# EAGLE design Peripheral (EAGLE 7.6.0)
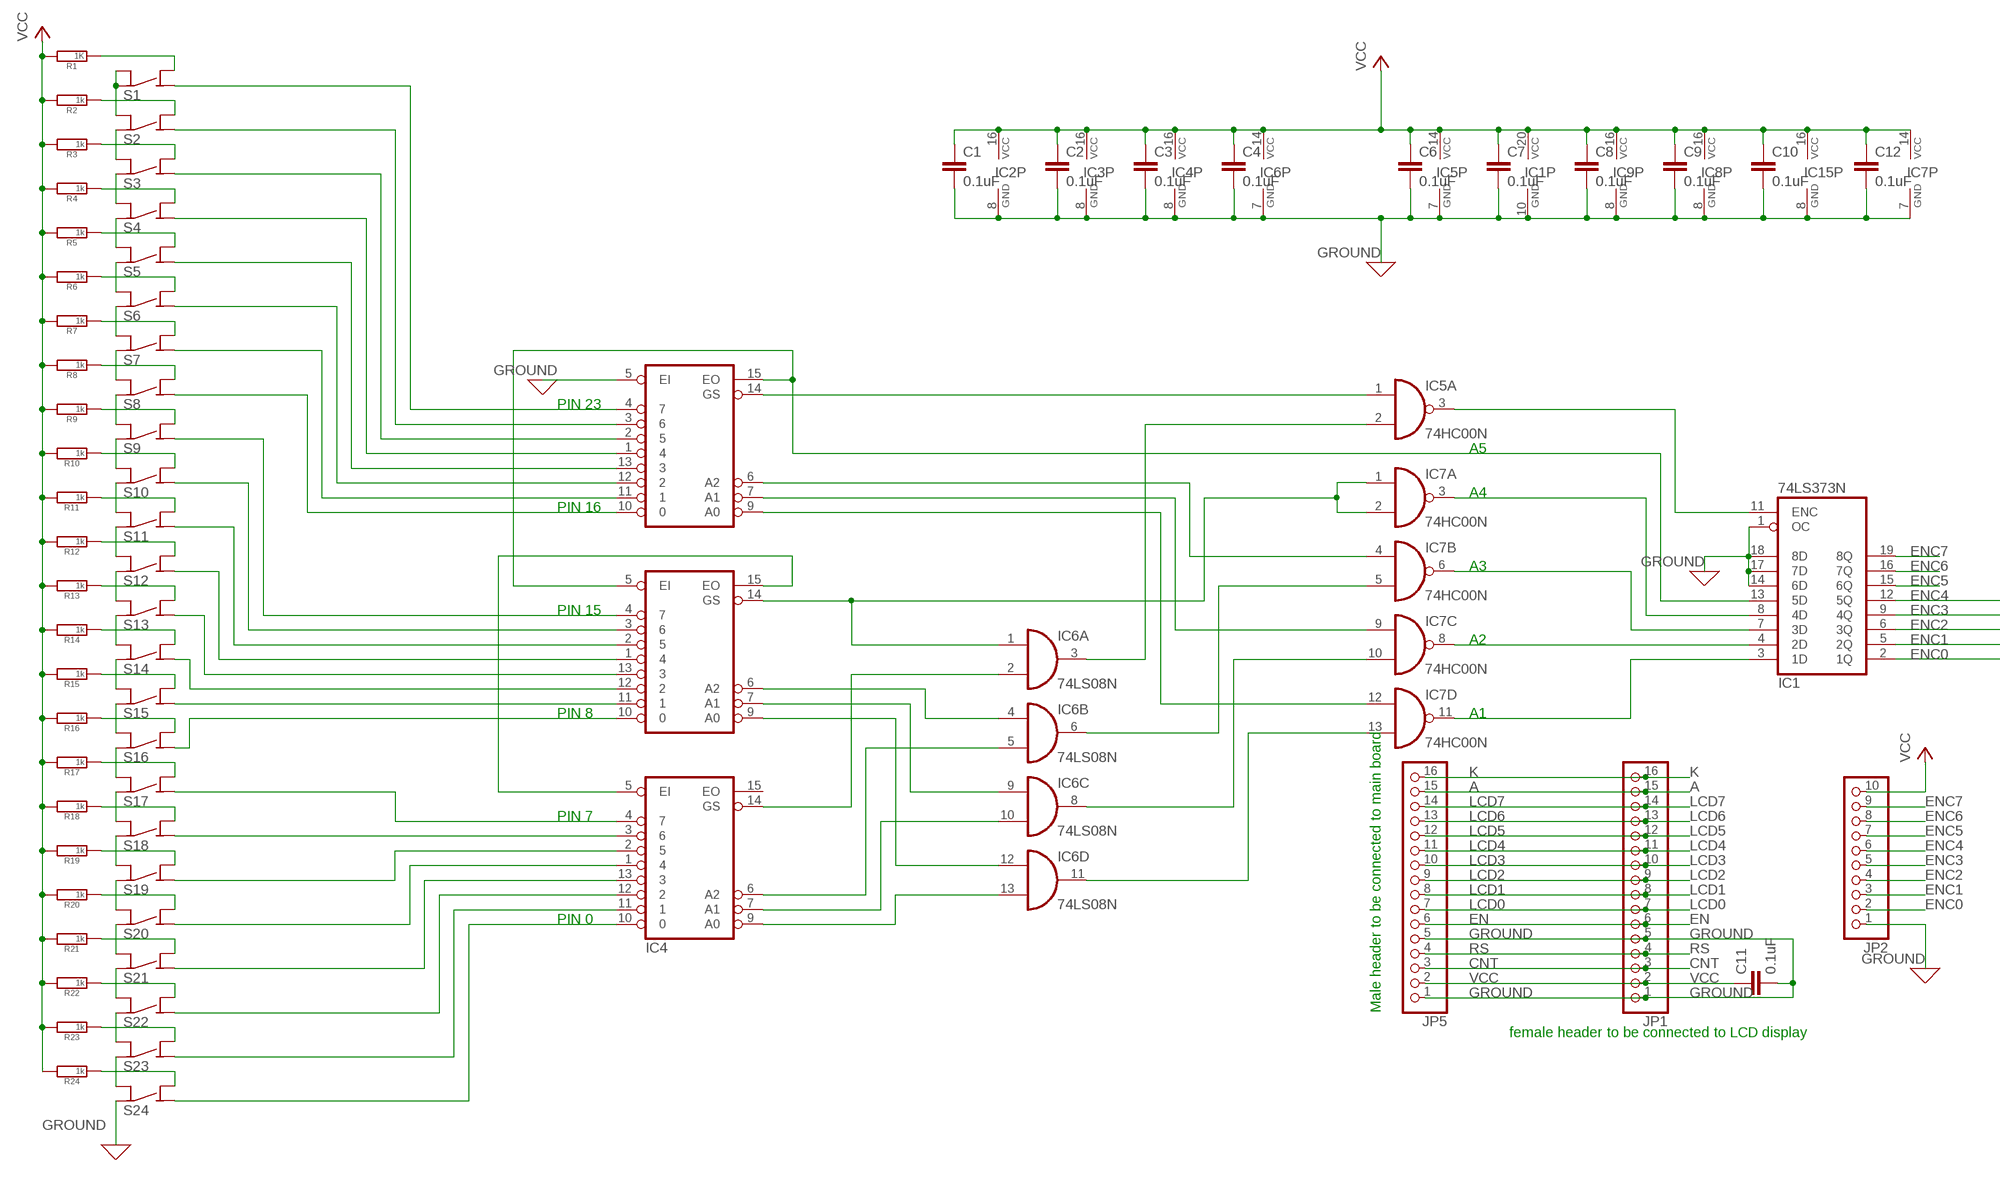
[diagram p0: schematic, sheet 1, part 1 of 2]
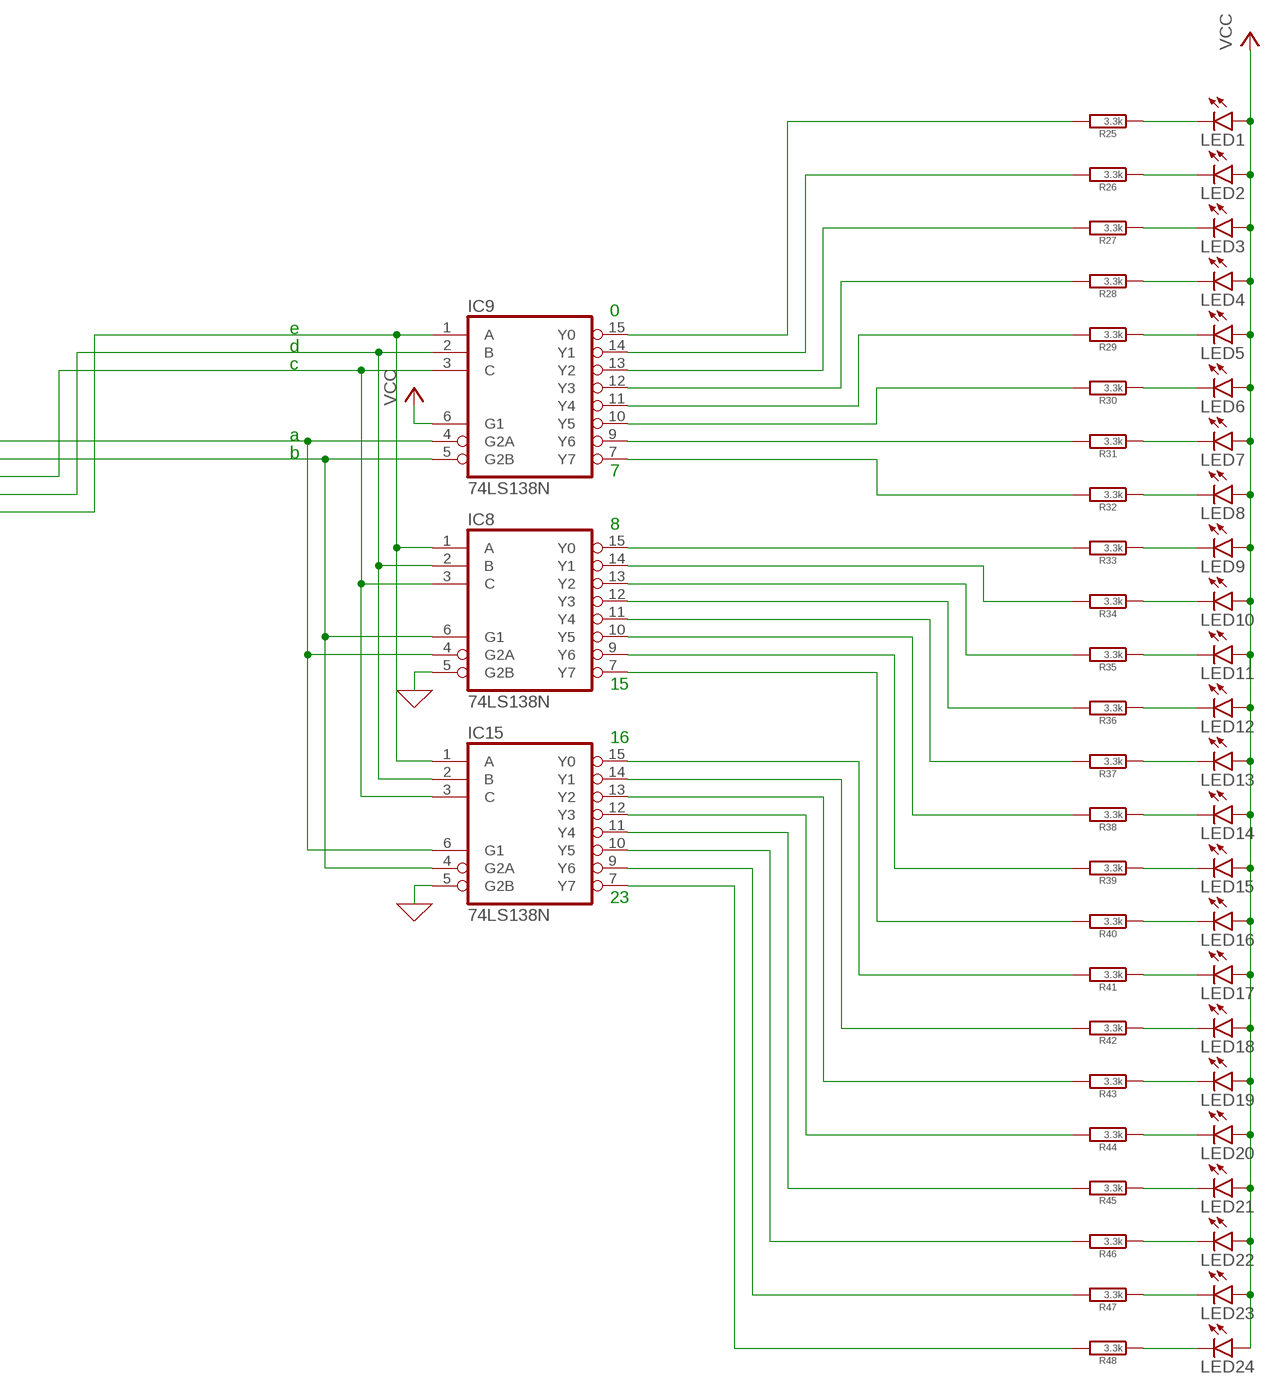
[diagram p1: schematic, sheet 1, part 2 of 2]

## Parts
C1  0.1uF  C2.5/2  [C2.5-2]
C2  0.1uF  C2.5/2  [C2.5-2]
C3  0.1uF  C2.5/2  [C2.5-2]
C4  0.1uF  C2.5/2  [C2.5-2]
C6  0.1uF  C2.5/2  [C2.5-2]
C7  0.1uF  C2.5/2  [C2.5-2]
C8  0.1uF  C2.5/2  [C2.5-2]
C9  0.1uF  C2.5/2  [C2.5-2]
C10  0.1uF  C2.5/2  [C2.5-2]
C11  0.1uF  C-EU025-025X050  [C025-025X050]
C12  0.1uF  C2.5/2  [C2.5-2]
IC1  74LS373N  [DIL20]
IC2  74HC148N  [DIL16]
IC3  74HC148N  [DIL16]
IC4  74HC148N  [DIL16]
IC5  74HC00N  [DIL14]
IC6  74LS08N  [DIL14]
IC7  74HC00N  [DIL14]
IC8  74LS138N  [DIL16]
IC9  74LS138N  [DIL16]
IC15  74LS138N  [DIL16]
JP1  PINHD-1X16  [1X16]
JP2  PINHD-1X10  [1X10]
JP5  PINHD-1X16  [1X16]
LED1  LED5MM  [LED5MM]
LED2  LED5MM  [LED5MM]
LED3  LED5MM  [LED5MM]
LED4  LED5MM  [LED5MM]
LED5  LED5MM  [LED5MM]
LED6  LED5MM  [LED5MM]
LED7  LED5MM  [LED5MM]
LED8  LED5MM  [LED5MM]
LED9  LED5MM  [LED5MM]
LED10  LED5MM  [LED5MM]
LED11  LED5MM  [LED5MM]
LED12  LED5MM  [LED5MM]
LED13  LED5MM  [LED5MM]
LED14  LED5MM  [LED5MM]
LED15  LED5MM  [LED5MM]
LED16  LED5MM  [LED5MM]
LED17  LED5MM  [LED5MM]
LED18  LED5MM  [LED5MM]
LED19  LED5MM  [LED5MM]
LED20  LED5MM  [LED5MM]
LED21  LED5MM  [LED5MM]
LED22  LED5MM  [LED5MM]
LED23  LED5MM  [LED5MM]
LED24  LED5MM  [LED5MM]
R1  1K  R>>1/6W(5MM)  [1/6W(5MM)]
R2  1k  R>>1/6W(5MM)  [1/6W(5MM)]
R3  1k  R>>1/6W(5MM)  [1/6W(5MM)]
R4  1k  R>>1/6W(5MM)  [1/6W(5MM)]
R5  1k  R>>1/6W(5MM)  [1/6W(5MM)]
R6  1k  R>>1/6W(5MM)  [1/6W(5MM)]
R7  1k  R>>1/6W(5MM)  [1/6W(5MM)]
R8  1k  R>>1/6W(5MM)  [1/6W(5MM)]
R9  1k  R>>1/6W(5MM)  [1/6W(5MM)]
R10  1k  R>>1/6W(5MM)  [1/6W(5MM)]
R11  1k  R>>1/6W(5MM)  [1/6W(5MM)]
R12  1k  R>>1/6W(5MM)  [1/6W(5MM)]
R13  1k  R>>1/6W(5MM)  [1/6W(5MM)]
R14  1k  R>>1/6W(5MM)  [1/6W(5MM)]
R15  1k  R>>1/6W(5MM)  [1/6W(5MM)]
R16  1k  R>>1/6W(5MM)  [1/6W(5MM)]
R17  1k  R>>1/6W(5MM)  [1/6W(5MM)]
R18  1k  R>>1/6W(5MM)  [1/6W(5MM)]
R19  1k  R>>1/6W(5MM)  [1/6W(5MM)]
R20  1k  R>>1/6W(5MM)  [1/6W(5MM)]
R21  1k  R>>1/6W(5MM)  [1/6W(5MM)]
R22  1k  R>>1/6W(5MM)  [1/6W(5MM)]
R23  1k  R>>1/6W(5MM)  [1/6W(5MM)]
R24  1k  R>>1/6W(5MM)  [1/6W(5MM)]
R25  3.3k  R>>1/6W(5MM)  [1/6W(5MM)]
R26  3.3k  R>>1/6W(5MM)  [1/6W(5MM)]
R27  3.3k  R>>1/6W(5MM)  [1/6W(5MM)]
R28  3.3k  R>>1/6W(5MM)  [1/6W(5MM)]
R29  3.3k  R>>1/6W(5MM)  [1/6W(5MM)]
R30  3.3k  R>>1/6W(5MM)  [1/6W(5MM)]
R31  3.3k  R>>1/6W(5MM)  [1/6W(5MM)]
R32  3.3k  R>>1/6W(5MM)  [1/6W(5MM)]
R33  3.3k  R>>1/6W(5MM)  [1/6W(5MM)]
R34  3.3k  R>>1/6W(5MM)  [1/6W(5MM)]
R35  3.3k  R>>1/6W(5MM)  [1/6W(5MM)]
R36  3.3k  R>>1/6W(5MM)  [1/6W(5MM)]
R37  3.3k  R>>1/6W(5MM)  [1/6W(5MM)]
R38  3.3k  R>>1/6W(5MM)  [1/6W(5MM)]
R39  3.3k  R>>1/6W(5MM)  [1/6W(5MM)]
R40  3.3k  R>>1/6W(5MM)  [1/6W(5MM)]
R41  3.3k  R>>1/6W(5MM)  [1/6W(5MM)]
R42  3.3k  R>>1/6W(5MM)  [1/6W(5MM)]
R43  3.3k  R>>1/6W(5MM)  [1/6W(5MM)]
R44  3.3k  R>>1/6W(5MM)  [1/6W(5MM)]
R45  3.3k  R>>1/6W(5MM)  [1/6W(5MM)]
R46  3.3k  R>>1/6W(5MM)  [1/6W(5MM)]
R47  3.3k  R>>1/6W(5MM)  [1/6W(5MM)]
R48  3.3k  R>>1/6W(5MM)  [1/6W(5MM)]
S1  SPST4B3F-10XX  [B3F-10XX]
S2  SPST4B3F-10XX  [B3F-10XX]
S3  SPST4B3F-10XX  [B3F-10XX]
S4  SPST4B3F-10XX  [B3F-10XX]
S5  SPST4B3F-10XX  [B3F-10XX]
S6  SPST4B3F-10XX  [B3F-10XX]
S7  SPST4B3F-10XX  [B3F-10XX]
S8  SPST4B3F-10XX  [B3F-10XX]
S9  SPST4B3F-10XX  [B3F-10XX]
S10  SPST4B3F-10XX  [B3F-10XX]
S11  SPST4B3F-10XX  [B3F-10XX]
S12  SPST4B3F-10XX  [B3F-10XX]
S13  SPST4B3F-10XX  [B3F-10XX]
S14  SPST4B3F-10XX  [B3F-10XX]
S15  SPST4B3F-10XX  [B3F-10XX]
S16  SPST4B3F-10XX  [B3F-10XX]
S17  SPST4B3F-10XX  [B3F-10XX]
S18  SPST4B3F-10XX  [B3F-10XX]
S19  SPST4B3F-10XX  [B3F-10XX]
S20  SPST4B3F-10XX  [B3F-10XX]
S21  SPST4B3F-10XX  [B3F-10XX]
S22  SPST4B3F-10XX  [B3F-10XX]
S23  SPST4B3F-10XX  [B3F-10XX]
S24  SPST4B3F-10XX  [B3F-10XX]

## Nets
A: JP1.15 JP5.15
CNT: JP1.3 JP5.3
EN: JP1.6 JP5.6
ENC0: IC1.2(1Q) IC8.1(A) IC9.1(A) IC15.1(A) JP2.2
ENC1: IC1.5(2Q) IC8.2(B) IC9.2(B) IC15.2(B) JP2.3
ENC2: IC1.6(3Q) IC8.3(C) IC9.3(C) IC15.3(C) JP2.4
ENC3: IC1.9(4Q) IC8.6(G1) IC9.5(G2B) IC15.4(G2A) JP2.5
ENC4: IC1.12(5Q) IC8.4(G2A) IC9.4(G2A) IC15.6(G1) JP2.6
ENC5: IC1.15(6Q) JP2.7
ENC6: IC1.16(7Q) JP2.8
ENC7: IC1.19(8Q) JP2.9
GROUND [GND]: C1.2 C2.2 C3.2 C4.2 C6.2 C7.2 C8.2 C9.2 C10.2 C11.2 C12.2 IC1.1(OC) IC1.10(GND) IC1.14(6D) IC1.17(7D) IC1.18(8D) IC2.5(EI) IC2.8(GND) IC3.8(GND) IC4.8(GND) IC5.7(P:GND) IC6.7(P:GND) IC7.7(P:GND) IC8.5(G2B) IC8.8(GND) IC9.8(GND) IC15.5(G2B) IC15.8(GND) JP1.1 JP1.5 JP2.1 JP5.1 JP5.5 S1.COM@1(COM) S1.COM@2(COM) S2.COM@1(COM) S2.COM@2(COM) S3.COM@1(COM) S3.COM@2(COM) S4.COM@1(COM) S4.COM@2(COM) S5.COM@1(COM) S5.COM@2(COM) S6.COM@1(COM) S6.COM@2(COM) S7.COM@1(COM) S7.COM@2(COM) S8.COM@1(COM) S8.COM@2(COM) S9.COM@1(COM) S9.COM@2(COM) S10.COM@1(COM) S10.COM@2(COM) S11.COM@1(COM) S11.COM@2(COM) S12.COM@1(COM) S12.COM@2(COM) S13.COM@1(COM) S13.COM@2(COM) S14.COM@1(COM) S14.COM@2(COM) S15.COM@1(COM) S15.COM@2(COM) S16.COM@1(COM) S16.COM@2(COM) S17.COM@1(COM) S17.COM@2(COM) S18.COM@1(COM) S18.COM@2(COM) S19.COM@1(COM) S19.COM@2(COM) S20.COM@1(COM) S20.COM@2(COM) S21.COM@1(COM) S21.COM@2(COM) S22.COM@1(COM) S22.COM@2(COM) S23.COM@1(COM) S23.COM@2(COM) S24.COM@1(COM) S24.COM@2(COM) ; supply symbol labelled GND
K: JP1.16 JP5.16
LCD0: JP1.7 JP5.7
LCD1: JP1.8 JP5.8
LCD2: JP1.9 JP5.9
LCD3: JP1.10 JP5.10
LCD4: JP1.11 JP5.11
LCD5: JP1.12 JP5.12
LCD6: JP1.13 JP5.13
LCD7: JP1.14 JP5.14
N$1: IC2.10 S8.NO@1(NO)
N$3: IC3.15(EO) IC4.5(EI)
N$4: IC2.11 S7.NO@1(NO)
N$5: IC2.9(A0) IC7.12(D:I0)
N$6: IC2.12 S6.NO@1(NO)
N$7: IC2.7(A1) IC7.9(C:I0)
N$8: IC2.13 S5.NO@1(NO)
N$9: IC2.1 S4.NO@1(NO)
N$10: IC3.9(A0) IC6.12(D:I0)
N$11: IC4.9(A0) IC6.13(D:I1)
N$12: IC3.7(A1) IC6.9(C:I0)
N$13: IC4.7(A1) IC6.10(C:I1)
N$14: IC3.6(A2) IC6.4(B:I0)
N$15: IC4.6(A2) IC6.5(B:I1)
N$16: IC2.2 S3.NO@1(NO)
N$17: IC6.11(D:O) IC7.13(D:I1)
N$18: IC2.3 S2.NO@1(NO)
N$19: IC6.8(C:O) IC7.10(C:I1)
N$20: IC2.6(A2) IC7.4(B:I0)
N$21: IC6.6(B:O) IC7.5(B:I1)
N$22: IC4.4 S17.NO@1(NO)
N$23: IC3.14(GS) IC6.1(A:I0) IC7.1(A:I0) IC7.2(A:I1)
N$24: R1.1 S1.NO@2(NO)
N$31: R2.1 S2.NO@2(NO)
N$32: R3.1 S3.NO@2(NO)
N$33: R4.1 S4.NO@2(NO)
N$34: R5.1 S5.NO@2(NO)
N$35: R6.1 S6.NO@2(NO)
N$36: R7.1 S7.NO@2(NO)
N$54: R8.1 S8.NO@2(NO)
N$55: R9.1 S9.NO@2(NO)
N$56: R10.1 S10.NO@2(NO)
N$57: R11.1 S11.NO@2(NO)
N$58: R12.1 S12.NO@2(NO)
N$59: R13.1 S13.NO@2(NO)
N$60: R14.1 S14.NO@2(NO)
N$61: R15.1 S15.NO@2(NO)
N$62: R16.1 S16.NO@2(NO)
N$63: R17.1 S17.NO@2(NO)
N$64: R18.1 S18.NO@2(NO)
N$65: R19.1 S19.NO@2(NO)
N$66: R20.1 S20.NO@2(NO)
N$67: R21.1 S21.NO@2(NO)
N$68: R22.1 S22.NO@2(NO)
N$69: R23.1 S23.NO@2(NO)
N$70: R24.1 S24.NO@2(NO)
N$71: IC1.3(1D) IC7.11(D:O)
N$72: IC1.4(2D) IC7.8(C:O)
N$73: IC4.2 S19.NO@1(NO)
N$74: IC4.1 S20.NO@1(NO)
N$75: IC4.13 S21.NO@1(NO)
N$76: IC4.12 S22.NO@1(NO)
N$77: IC4.11 S23.NO@1(NO)
N$78: IC4.10 S24.NO@1(NO)
N$79: IC4.3 S18.NO@1(NO)
N$80: IC1.7(3D) IC7.6(B:O)
N$81: IC1.8(4D) IC7.3(A:O)
N$82: IC4.14(GS) IC6.2(A:I1)
N$83: IC2.14(GS) IC5.1(A:I0)
N$84: IC2.4 S1.NO@1(NO)
N$85: IC5.2(A:I1) IC6.3(A:O)
N$86: IC3.4 S9.NO@1(NO)
N$87: IC3.10 S16.NO@1(NO)
N$88: IC3.11 S15.NO@1(NO)
N$89: IC3.12 S14.NO@1(NO)
N$90: IC3.13 S13.NO@1(NO)
N$91: IC3.1 S12.NO@1(NO)
N$92: IC3.2 S11.NO@1(NO)
N$93: IC3.3 S10.NO@1(NO)
N$94: IC1.11(ENC) IC5.3(A:O)
N$98: IC1.13(5D) IC2.15(EO) IC3.5(EI)
N$151: IC9.15(Y0) R25.2
N$152: LED1.K(C) R25.1
N$153: IC9.14(Y1) R26.2
N$154: IC9.13(Y2) R27.2
N$155: IC9.12(Y3) R28.2
N$156: IC9.11(Y4) R29.2
N$157: IC9.10(Y5) R30.2
N$158: IC9.9(Y6) R31.2
N$159: IC9.7(Y7) R32.2
N$160: IC8.15(Y0) R33.2
N$161: IC8.14(Y1) R34.2
N$162: IC8.13(Y2) R35.2
N$163: IC8.12(Y3) R36.2
N$164: IC8.11(Y4) R37.2
N$165: IC8.10(Y5) R38.2
N$166: IC8.9(Y6) R39.2
N$167: IC8.7(Y7) R40.2
N$168: IC15.15(Y0) R41.2
N$169: IC15.14(Y1) R42.2
N$170: IC15.13(Y2) R43.2
N$171: IC15.12(Y3) R44.2
N$172: IC15.11(Y4) R45.2
N$173: IC15.10(Y5) R46.2
N$174: IC15.9(Y6) R47.2
N$175: IC15.7(Y7) R48.2
N$176: LED2.K(C) R26.1
N$177: LED3.K(C) R27.1
N$178: LED4.K(C) R28.1
N$179: LED5.K(C) R29.1
N$180: LED6.K(C) R30.1
N$181: LED7.K(C) R31.1
N$182: LED8.K(C) R32.1
N$183: LED9.K(C) R33.1
N$184: LED10.K(C) R34.1
N$185: LED11.K(C) R35.1
N$186: LED12.K(C) R36.1
N$187: LED13.K(C) R37.1
N$188: LED14.K(C) R38.1
N$189: LED15.K(C) R39.1
N$190: LED16.K(C) R40.1
N$191: LED17.K(C) R41.1
N$192: LED18.K(C) R42.1
N$193: LED19.K(C) R43.1
N$194: LED20.K(C) R44.1
N$195: LED21.K(C) R45.1
N$196: LED22.K(C) R46.1
N$199: LED23.K(C) R47.1
N$200: LED24.K(C) R48.1
RS: JP1.4 JP5.4
VCC [VCC]: C1.1 C2.1 C3.1 C4.1 C6.1 C7.1 C8.1 C9.1 C10.1 C11.1 C12.1 IC1.20(VCC) IC2.16(VCC) IC3.16(VCC) IC4.16(VCC) IC5.14(P:VCC) IC6.14(P:VCC) IC7.14(P:VCC) IC8.16(VCC) IC9.6(G1) IC9.16(VCC) IC15.16(VCC) JP1.2 JP2.10 JP5.2 LED1.A LED2.A LED3.A LED4.A LED5.A LED6.A LED7.A LED8.A LED9.A LED10.A LED11.A LED12.A LED13.A LED14.A LED15.A LED16.A LED17.A LED18.A LED19.A LED20.A LED21.A LED22.A LED23.A LED24.A R1.2 R2.2 R3.2 R4.2 R5.2 R6.2 R7.2 R8.2 R9.2 R10.2 R11.2 R12.2 R13.2 R14.2 R15.2 R16.2 R17.2 R18.2 R19.2 R20.2 R21.2 R22.2 R23.2 R24.2
Unconnected: IC4.15(EO) IC5.4(B:I0) IC5.5(B:I1) IC5.6(B:O) IC5.8(C:O) IC5.9(C:I0) IC5.10(C:I1) IC5.11(D:O) IC5.12(D:I0) IC5.13(D:I1)

## Notes on the sheet
- PIN 23
- A5
- A4 | 0
- PIN 16 | e
- d
- c
- A3
- a
- PIN 15 | b
- 7
- A2
- 8
- PIN 8 | A1
- 15
- PIN 7
- 16
- PIN 0
- 23
- Male header to be connected to main board
- female header to be connected to LCD display

## Library data of the parts
C1-C4 C6-C10 C12 = capacitor-wima:C: CAPACITOR naming: grid - package width
C11 = rcl:C-EU: CAPACITOR, European symbol; SPICEPREFIX: C
IC1 = 74xx-eu:74*373: Octal D type transparent LATCH, edge triggered
IC2-IC4 = 74xx-eu:74*148: 10-line to 4-line and 8-line to 3-line PRIORITY ENCODER
IC5 IC7 = 74xx-eu:74*00: Quad 2-input NAND gate
IC6 = 74xx-eu:74*08: Quad 2-input AND gate
IC8 IC9 IC15 = 74xx-eu:74*138: 3-line to 8-line DECODER/DEMULTIPLEXER
JP1 JP5 = pinhead:PINHD-1X16: PIN HEADER
JP2 = pinhead:PINHD-1X10: PIN HEADER
LED1-LED24 = bt_opto:LED: LED Various packages
R1-R48 = !Resistor(抵抗):R>>: RESISTOR, European symbol
S1-S24 = bt_electromech:SPST4: SPST switch with 2 pins per contact

## Net classes
0 default: width 0.406 mm, drill 0.254 mm, clearance 0.254 mm
1 VCC: width 0.61 mm, drill 0.254 mm, clearance 0.254 mm
2 GND: width 0.61 mm, drill 0.254 mm, clearance 0.254 mm

## Board
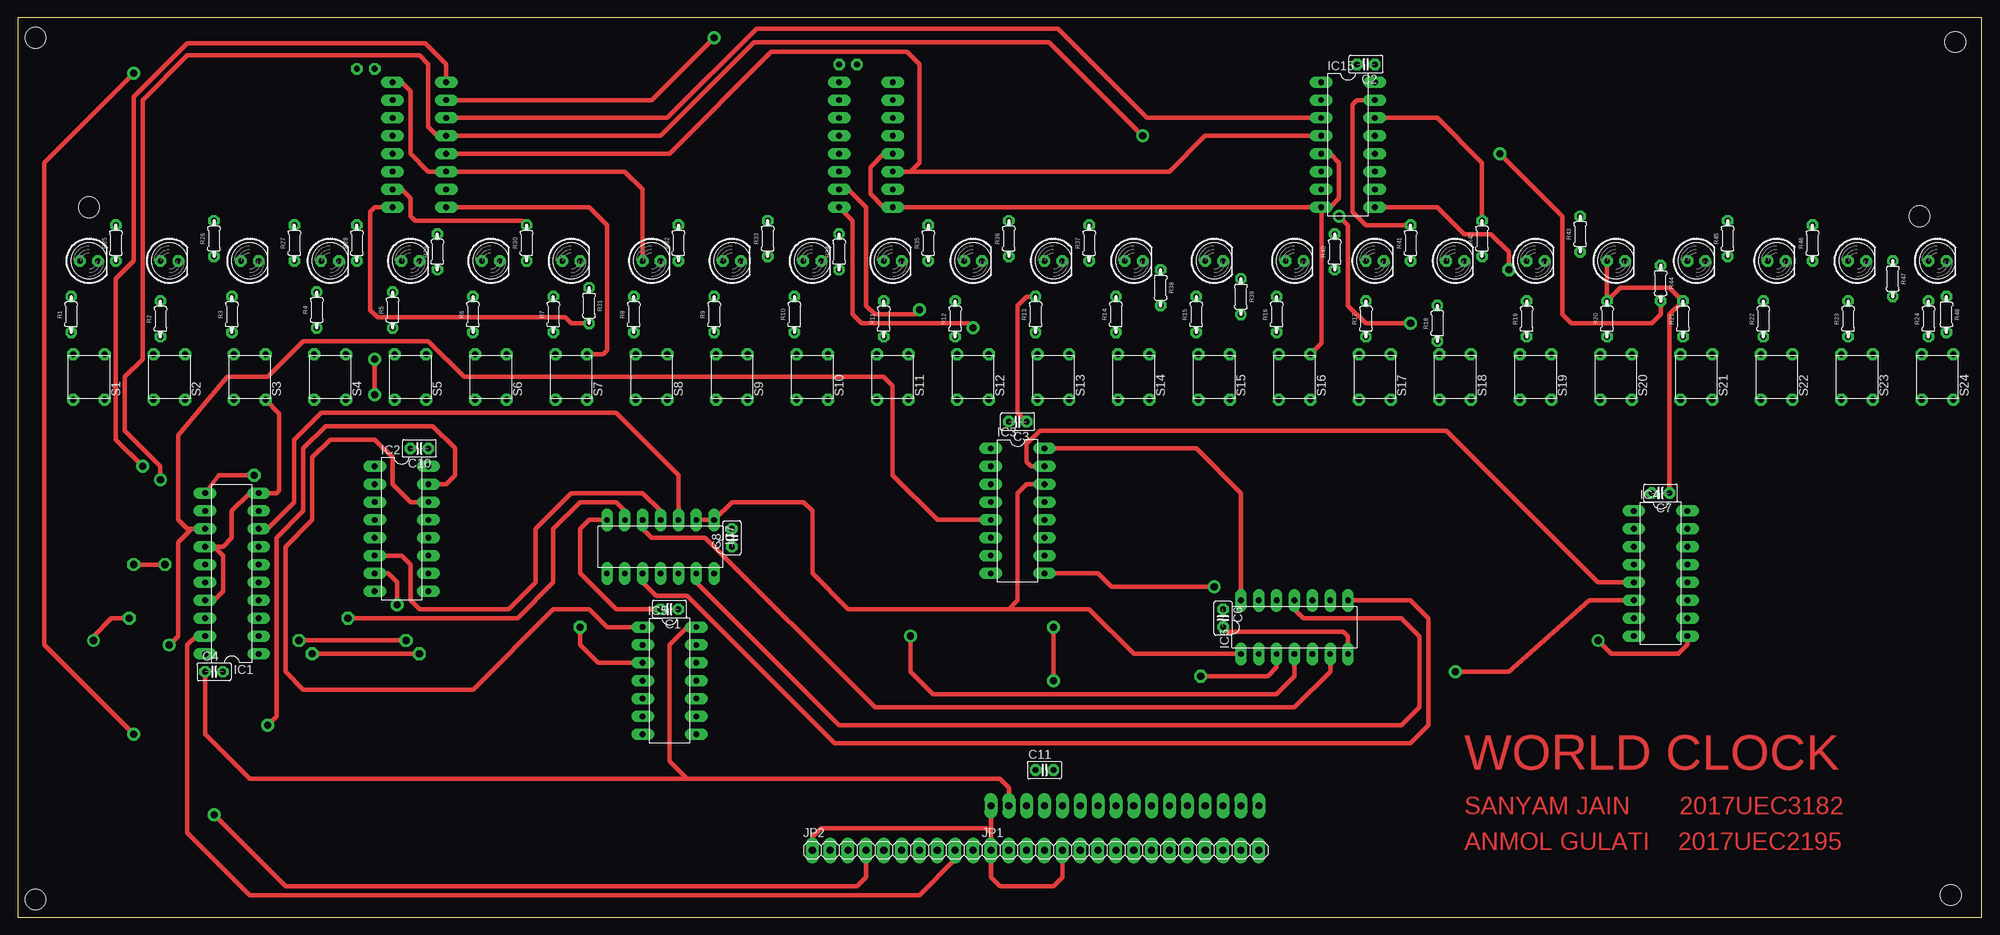
[diagram p2: board, top side]
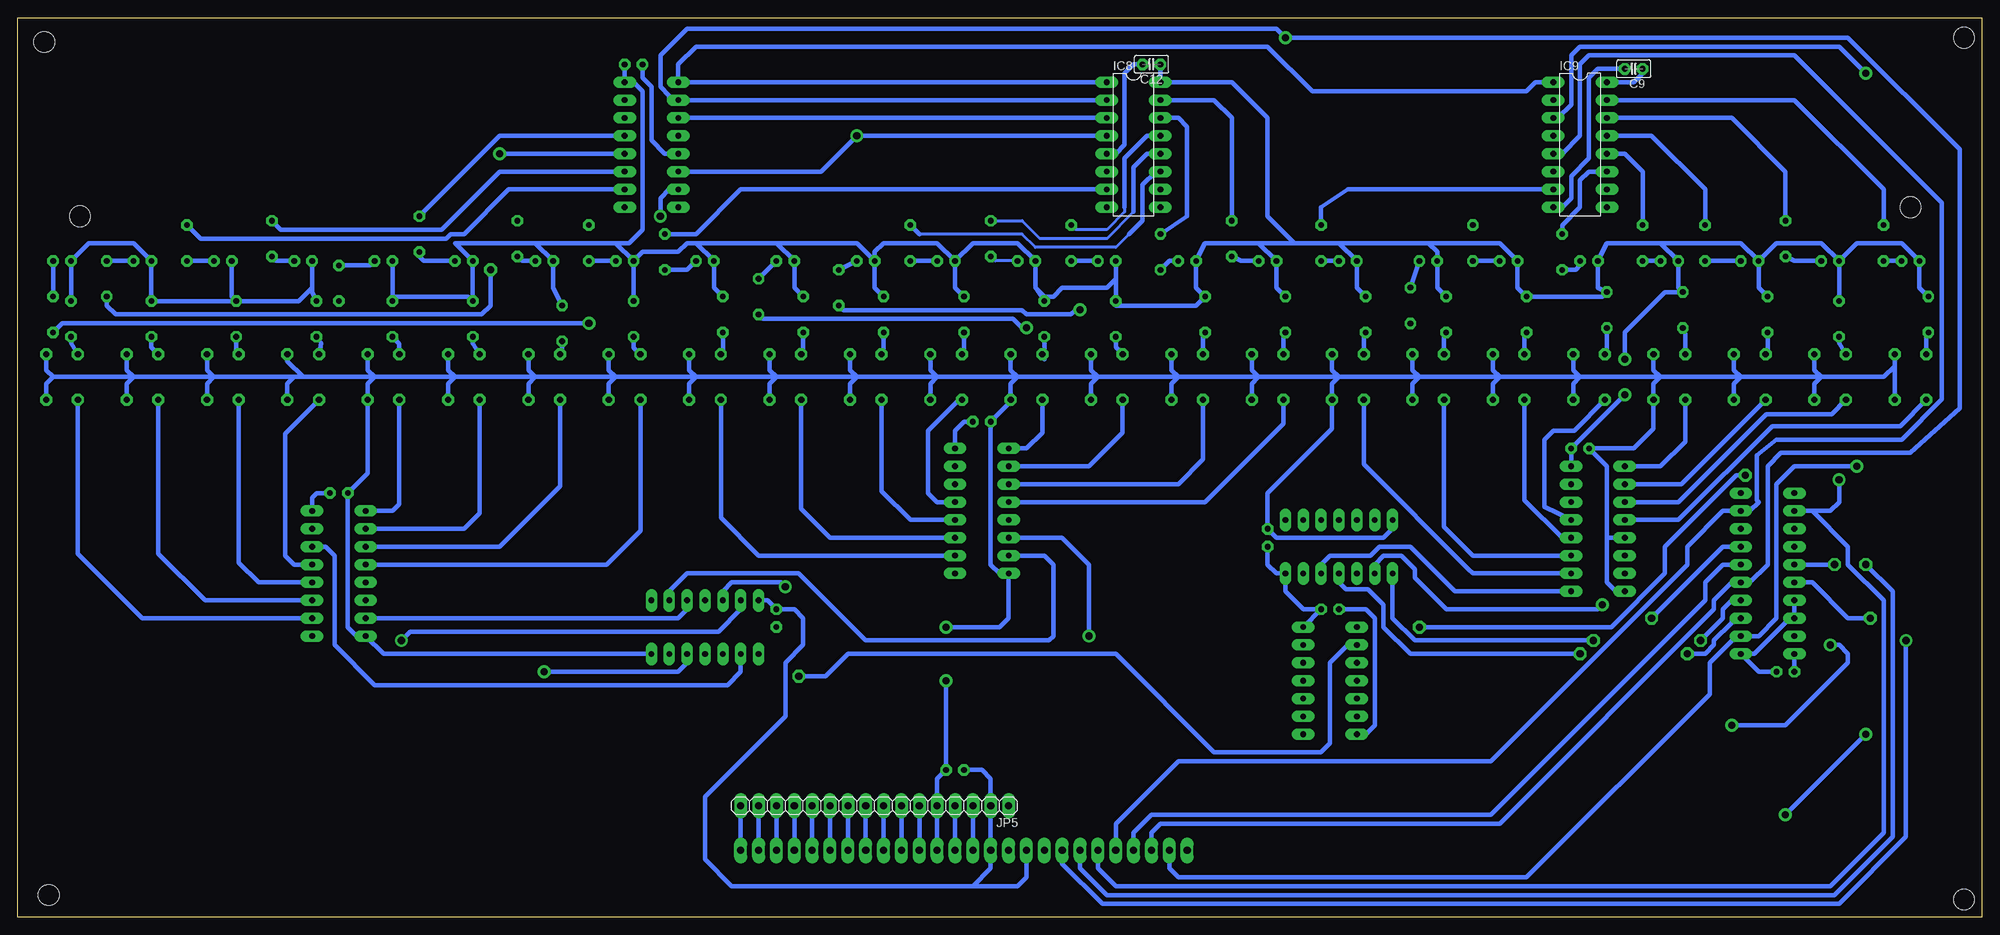
[diagram p3: board, bottom side, seen from below]

Size 279.38 x 127.94 mm. Coordinates in mm from the lower left corner, seen from the top.
Outline: 0,0 279.38,0 279.38,127.94 0,127.94 0,0
Copper layers (1*16): Top 0.035mm / dielectric 1.5mm / Bottom 0.035mm
Design rules "default *": minimum track width 6mil, minimum drill 0.35mm, track to track 16mil, track to pad 10mil, pad to pad 16mil, via to via 6mil, smd to smd 6mil, copper to edge 40mil, drill to drill 6mil, minimum pad ring 16mil, minimum via ring 16mil, stop-mask expansion 4mil, vias tented up to drill 0mil, thermal gap 10mil
Holes 3 mm at 2.54,2.54 274.95,3.18 275.59,124.46 2.54,125.09 10.16,100.97 270.51,99.69

### Footprints (pad centres in the part's own frame; a part is rotated, then mirrored left to right if it is on the bottom)
C2.5-2 = drill 0.813 pad 1.6 octagon: 1 -1.27,0; 2 1.27,0
C025-025X050 = drill 0.813 octagon: 1 -1.27,0; 2 1.27,0
DIL20 = drill 0.813 long: 1 -11.43,-3.81; 2 -8.89,-3.81; 3 -6.35,-3.81; 4 -3.81,-3.81; 5 -1.27,-3.81; 6 1.27,-3.81; 7 3.81,-3.81; 8 6.35,-3.81; 9 8.89,-3.81; 10 11.43,-3.81; 11 11.43,3.81; 12 8.89,3.81; 13 6.35,3.81; 14 3.81,3.81; 15 1.27,3.81; 16 -1.27,3.81; 17 -3.81,3.81; 18 -6.35,3.81; 19 -8.89,3.81; 20 -11.43,3.81
DIL16 = drill 0.813 long: 1 -8.89,-3.81; 2 -6.35,-3.81; 3 -3.81,-3.81; 4 -1.27,-3.81; 5 1.27,-3.81; 6 3.81,-3.81; 7 6.35,-3.81; 8 8.89,-3.81; 9 8.89,3.81; 10 6.35,3.81; 11 3.81,3.81; 12 1.27,3.81; 13 -1.27,3.81; 14 -3.81,3.81; 15 -6.35,3.81; 16 -8.89,3.81
DIL14 = drill 0.813 long: 1 -7.62,-3.81; 2 -5.08,-3.81; 3 -2.54,-3.81; 4 0,-3.81; 5 2.54,-3.81; 6 5.08,-3.81; 7 7.62,-3.81; 8 7.62,3.81; 9 5.08,3.81; 10 2.54,3.81; 11 0,3.81; 12 -2.54,3.81; 13 -5.08,3.81; 14 -7.62,3.81
1X16 = drill 1.016 long: 1 -19.05,0; 2 -16.51,0; 3 -13.97,0; 4 -11.43,0; 5 -8.89,0; 6 -6.35,0; 7 -3.81,0; 8 -1.27,0; 9 1.27,0; 10 3.81,0; 11 6.35,0; 12 8.89,0; 13 11.43,0; 14 13.97,0; 15 16.51,0; 16 19.05,0
1X10 = drill 1.016 long: 1 -11.43,0; 2 -8.89,0; 3 -6.35,0; 4 -3.81,0; 5 -1.27,0; 6 1.27,0; 7 3.81,0; 8 6.35,0; 9 8.89,0; 10 11.43,0
LED5MM = drill 0.813 octagon: A -1.27,0; K 1.27,0
1/6W(5MM) = drill 0.8 pad 1.27 octagon: 1 -2.54,0; 2 2.54,0
B3F-10XX = drill 0.889 octagon: COM@1 -3.25,-2.25; COM@2 3.25,-2.25; NO@1 -3.25,2.25; NO@2 3.25,2.25

### Placement (x,y rotation side)
C1  92.71,43.81 180 top
C2  191.77,121.28 180 top
C3  142.24,70.48 180 top
C4  27.94,34.92 0 top
C6  171.45,42.55 270 top
C7  233.68,60.33 180 top
C8  101.6,53.98 90 top
C9  49.53,120.65 180 bottom
C10  57.15,66.67 180 top
C11  146.05,20.95 0 top
C12  118.11,121.28 180 bottom
IC1  30.48,48.89 90 top
IC2  54.61,55.25 270 top
IC3  142.24,57.78 270 top
IC4  233.68,48.89 270 top
IC5  92.71,33.66 270 top
IC6  181.61,41.27 0 top
IC7  91.44,52.7 180 top
IC8  120.65,109.85 270 bottom
IC9  57.15,109.85 270 bottom
IC15  189.23,109.85 270 top
JP1  157.48,9.52 0 top
JP2  124.46,9.52 0 top
JP5  157.48,15.88 180 bottom
LED1  10.16,93.34 0 top
LED2  21.59,93.34 0 top
LED3  33.02,93.34 0 top
LED4  44.45,93.34 0 top
LED5  55.88,93.34 0 top
LED6  67.31,93.34 0 top
LED7  78.74,93.34 0 top
LED8  90.17,93.34 0 top
LED9  101.6,93.34 0 top
LED10  113.03,93.34 0 top
LED11  124.46,93.34 0 top
LED12  135.89,93.34 0 top
LED13  147.32,93.34 0 top
LED14  158.75,93.34 0 top
LED15  170.18,93.34 0 top
LED16  181.61,93.34 0 top
LED17  193.04,93.34 0 top
LED18  204.47,93.34 0 top
LED19  215.9,93.34 0 top
LED20  227.33,93.34 0 top
LED21  238.76,93.34 0 top
LED22  250.19,93.34 0 top
LED23  261.62,93.34 0 top
LED24  273.05,93.34 0 top
R1  7.62,85.72 90 top
R2  20.32,85.09 90 top
R3  30.48,85.72 90 top
R4  42.55,86.36 90 top
R5  53.34,86.36 90 top
R6  64.77,85.72 90 top
R7  76.2,85.72 90 top
R8  87.63,85.72 90 top
R9  99.06,85.72 90 top
R10  110.49,85.72 90 top
R11  123.19,85.09 90 top
R12  133.35,85.09 90 top
R13  144.78,85.72 90 top
R14  156.21,85.72 90 top
R15  167.64,85.72 90 top
R16  179.07,85.72 90 top
R17  191.77,85.09 90 top
R18  201.93,84.45 90 top
R19  214.63,85.09 90 top
R20  226.06,85.09 90 top
R21  236.86,85.09 90 top
R22  248.28,85.09 90 top
R23  260.35,85.09 90 top
R24  271.78,85.09 90 top
R25  13.97,95.88 90 top
R26  27.94,96.52 90 top
R27  39.37,95.88 90 top
R28  48.26,95.88 90 top
R29  59.69,94.61 90 top
R30  72.39,95.88 90 top
R31  81.28,87 270 top
R32  93.98,95.88 90 top
R33  106.68,96.52 90 top
R34  116.84,94.61 90 top
R35  129.54,95.88 90 top
R36  140.97,96.52 90 top
R37  152.4,95.88 90 top
R38  162.56,89.53 270 top
R39  173.99,88.27 270 top
R40  187.33,94.61 90 top
R41  198.12,95.88 90 top
R42  208.28,96.52 90 top
R43  222.25,97.16 90 top
R44  233.68,90.17 270 top
R45  243.21,96.52 90 top
R46  255.27,95.88 90 top
R47  266.7,90.8 270 top
R48  274.32,85.72 270 top
S1  10.16,76.83 90 top
S2  21.59,76.83 90 top
S3  33.02,76.83 90 top
S4  44.45,76.83 90 top
S5  55.88,76.83 90 top
S6  67.31,76.83 90 top
S7  78.74,76.83 90 top
S8  90.17,76.83 90 top
S9  101.6,76.83 90 top
S10  113.03,76.83 90 top
S11  124.46,76.83 90 top
S12  135.89,76.83 90 top
S13  147.32,76.83 90 top
S14  158.75,76.83 90 top
S15  170.18,76.83 90 top
S16  181.61,76.83 90 top
S17  193.04,76.83 90 top
S18  204.47,76.83 90 top
S19  215.9,76.83 90 top
S20  227.33,76.83 90 top
S21  238.76,76.83 90 top
S22  250.19,76.83 90 top
S23  261.62,76.83 90 top
S24  273.05,76.83 90 top

### Tracks (layer width: path | path; a pad name or v marks a point on that pad's centre or on a via)
A
  Bottom 0.61: JP5.15 JP1.15
CNT
  Bottom 0.61: JP5.3 JP1.3
EN
  Bottom 0.61: JP5.6 JP1.6
ENC0  (via drill 1.02)
  Top 0.61: IC9.1 60.96,121.28 57.94,124.3 24.13,124.3 16.51,116.68 16.51,93.34 13.97,90.8 13.97,67.94 v17.78,64.14
  Bottom 0.61: IC8.1 IC15.1 185.42,121.28 182.88,123.83 101.6,123.83 95.25,117.47 64.77,117.47 63.5,118.74 IC9.1 | v17.78,64.14 26.67,64.14 29.21,61.59 29.21,42.55 31.75,40.01 IC1.2 34.93,40.01 38.73,36.2 38.73,31.75 64.77,5.71 114.3,5.71 115.57,6.98 JP2.2
ENC1  (via drill 1.02)
  Top 0.61: v99.06,125.09 90.17,116.2 IC9.2
  Bottom 0.61: JP2.3 118.11,12.06 116.84,13.34 68.58,13.34 38.1,43.81 38.1,45.09 35.56,47.62 IC1.5 33.02,47.62 30.48,50.16 30.48,64.14 28.57,66.04 10.16,66.04 3.17,72.39 3.17,109.22 19.05,125.09 v99.06,125.09 100.33,126.36 184.15,126.36 187.96,122.55 187.96,118.11 186.69,116.84 186.69,116.2 IC15.2 IC8.2
ENC2  (via drill 1.02)
  Top 0.61: IC15.3 160.66,113.66 147.96,126.36 105.09,126.36 92.39,113.66 IC9.3 | JP2.4 120.65,5.71 119.38,4.45 38.1,4.45 v27.94,14.61 | v16.51,26.04 3.81,38.73 3.81,107.31 v16.51,120.02
  Bottom 0.61: IC8.3 IC15.3 | IC9.3 60.33,113.66 58.42,115.57 58.42,122.55 57.15,123.83 20.32,123.83 v16.51,120.02 | v27.94,14.61 v16.51,26.04 | JP2.4 120.65,12.06 118.13,14.58 71.12,14.58 | 71.12,14.58 69.87,14.58 | IC1.6 36.83,50.16 39.37,47.62 39.37,45.09 69.85,14.61 71.1,14.61 71.12,14.58
ENC3
  Top 0.61: IC8.6 127,106.05 | 127,106.05 163.83,106.05 168.91,111.12 IC15.4 | 127,106.05 128.27,107.31 128.27,121.28 126.5,123.05 107.18,123.05 92.71,108.58 IC9.5
  Bottom 0.61: JP2.5 123.19,13.34 114.3,22.23 69.85,22.23 41.91,50.16 41.91,52.7 36.83,57.78 IC1.9 33.02,57.78 31.75,59.06 32,59.3 32,65.72 29.21,67.94 11.43,67.94 5.72,73.66 5.72,101.6 26.71,122.59 55.88,122.59 55.88,122.55 57.15,121.28 57.15,111.12 59.69,108.58 IC9.5
ENC4  (via drill 1.02)
  Top 0.61: v20.32,62.23 20.32,64.14 15.24,69.22 15.24,76.83 17.78,79.38 17.78,116.2 24.13,122.55 57.15,122.55 58.42,121.28 58.42,112.39 59.69,111.12 IC9.4 91.44,111.12 104.77,124.46 146.69,124.46 v160.02,111.12
  Bottom 0.61: IC8.4 v160.02,111.12 165.1,106.05 IC15.6 | JP2.6 125.73,6.98 123.19,4.45 21.59,4.45 13.97,12.06 13.97,45.09 19.05,50.16 19.05,52.7 24.13,57.78 | v20.32,62.23 20.32,59.06 21.59,57.78 24.13,57.78 | IC1.12 24.13,57.78
ENC5  (via drill 1.02)
  Top 0.61: v16.51,50.16 v20.96,50.16
  Bottom 0.61: v16.51,50.16 12.7,46.36 12.7,11.43 21,3.13 119.38,3.13 120.65,3.13 124.41,3.13 128.27,6.98 JP2.7 | v20.96,50.16 IC1.15
ENC6  (via drill 1.02)
  Top 0.61: v15.88,42.55 13.34,42.55 10.8,40.01 v10.8,39.37
  Bottom 0.61: v15.88,42.55 19.05,42.55 24.13,47.62 IC1.16 | v10.8,39.37 10.8,11.43 20.32,1.91 125.09,1.91 130.81,7.62 JP2.8
ENC7
  Top 0.61: JP2.9 133.35,8.25 128.27,3.18 33.02,3.18 24.13,12.06 24.13,38.73 25.4,40.01 IC1.19
GROUND  (via drill 1.02)
  Top 0.61: v147.32,33.66 v147.32,41.27 | C1.2 85.09,43.81 80.01,48.89 80.01,55.25 81.28,56.52 IC7.7 | IC6.7 189.23,40.01 188.59,40.64 172.09,40.64 C6.2 | JP2.1 113.03,11.43 114.3,12.7 137.8,12.7 138.43,12.06 | 138.43,12.06 JP1.1 138.43,5.71 139.7,4.45 147.32,4.45 148.59,5.71 JP1.5 | IC1.17 27.94,45.09 29.21,46.36 29.21,51.44 27.94,52.7 IC1.14 29.21,52.7 30.48,53.98 30.48,57.78 33.02,60.33 IC1.10 36.83,60.33 37.24,60.73 37.24,71.62 S3.COM@1 | IC15.5 186.69,108.58 187.96,107.31 187.96,102.23 186.69,100.97 IC15.8 | IC15.8 IC8.8 123.19,100.97 121.28,102.87 121.28,106.68 123.19,108.58 IC8.5 | IC9.8 81.28,100.97 83.82,98.42 83.82,80.64 83.26,80.08 S7.COM@2 | JP5.1 138.43,12.06 | IC15.8 185.42,81.64 S16.COM@2
  Bottom 0.61: JP1.5 JP5.5 148.59,19.69 C11.2 v147.32,33.66 | IC6.7 227.33,37.47 IC4.8 231.14,40.01 232.41,41.27 C7.2 229.58,63.16 S20.COM@1 229.58,75.86 228.6,76.83 | 53.34,53.98 IC2.5 | IC2.8 52.07,46.36 53.34,47.62 53.34,53.98 | S1.COM@1 S1.COM@2 12.41,78.39 13.97,76.83 22.86,76.83 | 274.32,76.83 262.89,76.83 | 262.89,76.83 251.46,76.83 | 251.46,76.83 240.03,76.83 | 240.03,76.83 238.76,76.83 | 238.76,76.83 228.6,76.83 | 228.6,76.83 217.17,76.83 | 217.17,76.83 205.74,76.83 | 205.74,76.83 194.31,76.83 | 194.31,76.83 182.88,76.83 | 182.88,76.83 171.45,76.83 | 171.45,76.83 160.02,76.83 | 160.02,76.83 148.59,76.83 | 148.59,76.83 137.16,76.83 | 137.16,76.83 125.73,76.83 | 125.73,76.83 114.3,76.83 | 114.3,76.83 102.87,76.83 | 102.87,76.83 91.44,76.83 | 91.44,76.83 80.01,76.83 | 80.01,76.83 68.58,76.83 | 68.58,76.83 57.15,76.83 | 57.15,76.83 45.72,76.83 | 45.72,76.83 34.29,76.83 | 34.29,76.83 22.86,76.83 | S24.COM@2 275.3,77.81 274.32,76.83 | S24.COM@1 275.3,75.86 274.32,76.83 | S23.COM@1 263.87,75.86 262.89,76.83 | S23.COM@2 263.87,77.81 262.89,76.83 | S22.COM@2 252.44,77.81 251.46,76.83 | S22.COM@1 252.44,75.86 251.46,76.83 | S21.COM@2 241.01,79.08 238.76,76.83 | S21.COM@1 241.01,75.86 240.03,76.83 | S2.COM@2 23.84,77.81 22.86,76.83 | S2.COM@1 23.84,75.86 22.86,76.83 | S3.COM@2 35.27,77.81 34.29,76.83 | S3.COM@1 35.27,75.86 34.29,76.83 | S4.COM@2 46.7,77.81 45.72,76.83 | 45.72,76.83 46.7,75.86 S4.COM@1 46.7,69.5 49.53,66.67 C10.2 53.34,64.14 53.34,53.98 | S5.COM@2 58.13,77.81 57.15,76.83 | S5.COM@1 58.13,75.86 57.15,76.83 | S6.COM@2 69.56,77.81 68.58,76.83 | S6.COM@1 69.56,75.86 68.58,76.83 | S7.COM@2 80.99,77.81 80.01,76.83 | S7.COM@1 80.99,75.86 80.01,76.83
  Bottom 0.61: S8.COM@2 92.42,77.81 91.44,76.83 | 91.44,76.83 92.42,75.86 S8.COM@1 92.42,69.5 101.6,60.33 C8.2 100.33,53.98 85.09,53.98 83.82,55.25 IC7.7 | S9.COM@2 103.85,77.81 102.87,76.83 | S9.COM@1 103.85,75.86 102.87,76.83 | S10.COM@2 115.28,77.81 114.3,76.83 | S10.COM@1 115.28,75.86 114.3,76.83 | S11.COM@2 126.71,77.81 125.73,76.83 | S11.COM@1 126.71,75.86 125.73,76.83 | S12.COM@2 138.14,77.81 137.16,76.83 | 137.16,76.83 138.14,75.86 S12.COM@1 138.43,73.3 138.43,73.03 C3.2 140.97,50.16 139.7,48.89 IC3.8 138.43,42.55 139.7,41.27 v147.32,41.27 | S13.COM@2 149.57,77.81 148.59,76.83 | S13.COM@1 149.57,75.86 148.59,76.83 | S14.COM@2 161,77.81 160.02,76.83 | S14.COM@1 161,75.86 160.02,76.83 | S15.COM@2 172.43,77.81 171.45,76.83 | S15.COM@1 172.43,75.86 171.45,76.83 | S16.COM@2 183.86,77.81 182.88,76.83 | S16.COM@1 183.86,75.86 182.88,76.83 | S17.COM@2 195.29,77.81 194.31,76.83 | S17.COM@1 195.29,75.86 194.31,76.83 | S18.COM@2 206.72,77.81 205.74,76.83 | S18.COM@1 206.72,75.86 205.74,76.83 | S19.COM@2 218.15,77.81 217.17,76.83 | S19.COM@1 218.15,75.86 217.17,76.83 | S20.COM@2 229.58,77.81 228.6,76.83 | IC15.5 187.33,108.58 189.23,110.49 189.23,118.11 190.5,119.38 C2.2 | IC8.5 123.19,108.58 121.92,109.85 121.92,120.02 120.65,121.28 C12.2 | IC9.8 59.69,100.97 58.42,102.23 58.42,105.41 55.88,107.95 55.88,119.38 54.61,120.65 C9.2 | IC1.17 IC1.18 27.3,42.55 32.38,37.47 IC1.1 31.75,34.92 C4.2 | C1.2 87.63,43.81 86.36,42.55 86.36,27.3 87.63,26.04 IC5.7
K
  Bottom 0.61: JP5.16 JP1.16
LCD0
  Bottom 0.61: JP5.7 JP1.7
LCD1
  Bottom 0.61: JP5.8 JP1.8
LCD2
  Bottom 0.61: JP5.9 JP1.9
LCD3
  Bottom 0.61: JP5.10 JP1.10
LCD4
  Bottom 0.61: JP5.11 JP1.11
LCD5
  Bottom 0.61: JP5.12 JP1.12
LCD6
  Bottom 0.61: JP5.13 JP1.13
LCD7
  Bottom 0.61: JP5.14 JP1.14
N$1
  Bottom 0.61: S8.NO@1 87.92,64.42 73.02,49.53 72.39,48.89 IC2.10
N$3
  Top 0.61: IC3.15 144.15,64.14 143.51,64.77 143.51,67.31 145.42,69.22 203.2,69.22 224.79,47.62 IC4.5
N$4
  Bottom 0.61: IC2.11 72.39,51.44 76.49,55.53 S7.NO@1
N$5
  Bottom 0.61: IC2.9 74.93,46.36 81.28,52.7 85.72,52.7 86.99,51.44 92.71,51.44 93.98,50.16 IC7.12
N$6
  Bottom 0.61: S6.NO@1 65.06,59.34 59.69,53.98 IC2.12
N$7  (via drill 1.02)
  Top 0.61: IC2.7 52.7,48.89 53.98,47.62 v53.98,44.45
  Bottom 0.61: IC7.9 86.36,50.16 85.09,51.44 82.55,51.44 80.64,49.53 80.64,48.26 76.2,43.81 54.61,43.81 v53.98,44.45
N$8
  Bottom 0.61: IC2.13 62.23,58.42 62.23,67.94 60.96,69.22 58,69.22 S5.NO@1
N$9
  Bottom 0.61: S4.NO@1 42.2,67.66 45.72,64.14 IC2.1
N$10  (via drill 1.02)
  Top 0.61: IC3.9 153.67,48.89 155.58,46.99 v170.18,46.99
  Bottom 0.61: IC6.12 179.07,46.36 177.8,47.62 170.81,47.62 v170.18,46.99
N$11  (via drill 1.02)
  Top 0.61: IC4.9 237.49,38.73 236.22,37.47 226.7,37.47 v224.79,39.37
  Bottom 0.61: IC6.13 176.53,43.81 179.71,40.64 223.52,40.64 v224.79,39.37
N$12
  Bottom 0.61: IC3.7 133.35,51.44 132.08,50.16 132.08,40.01 132.72,39.37 158.75,39.37 168.28,48.89 184.15,48.89 186.69,46.36 IC6.9
N$13
  Bottom 0.61: IC4.7 185.42,42.55 184.15,43.81 IC6.10
N$14  (via drill 1.02)
  Top 0.61: v127,40.01 127,34.92 130.18,31.75 179.07,31.75 181.61,34.29 IC6.4
  Bottom 0.61: IC3.6 130.81,53.98 127,50.16 127,46.36 v127,40.01
N$15  (via drill 1.02)
  Top 0.61: v204.47,34.92 212.09,34.92 223.52,45.09 IC4.6
  Bottom 0.61: IC6.5 184.15,36.2 185.42,34.92 v204.47,34.92
N$16
  Bottom 0.61: S3.NO@1 42.76,61.59 IC2.2
N$17
  Top 0.61: IC6.11 181.61,43.81 182.88,42.55 196.85,42.55 199.39,40.01 199.39,29.84 196.85,27.3 116.84,27.3 97.15,46.99 96.52,47.62 IC7.13
N$18
  Bottom 0.61: S2.NO@1 21.38,71.55 30.69,71.55 43.18,59.06 IC2.3
N$19
  Top 0.61: IC6.8 198.12,45.09 200.66,42.55 200.66,27.3 198.12,24.77 116.2,24.77 95.25,45.72 90.8,45.72 88.9,47.62 IC7.10
N$20
  Top 0.61: IC7.4 91.44,57.78 88.9,60.33 78.74,60.33 73.66,55.25 73.66,47.62 69.85,43.81 57.15,43.81 55.88,45.09 55.88,50.16 54.61,51.44 IC2.6
N$21
  Top 0.61: IC6.6 186.69,34.92 181.61,29.84 121.92,29.84 97.79,53.98 90.17,53.98 88.9,55.25 IC7.5
N$22
  Bottom 0.61: S17.NO@1 190.79,54.95 195.58,50.16 IC4.4
N$23
  Top 0.61: IC3.14 143.51,61.59 142.24,60.33 142.24,45.09 140.97,43.81 | 140.97,43.81 139.7,43.81 118.11,43.81 113.03,48.89 113.03,57.78 111.76,59.06 101.6,59.06 IC7.1 IC7.2 | IC6.1 158.75,37.47 152.4,43.81 140.97,43.81
N$24
  Bottom 0.61: S1.NO@2 7.91,82.89 R1.1
N$31
  Bottom 0.61: R2.1 20.32,81.64 S2.NO@2
N$32
  Bottom 0.61: S3.NO@2 30.48,80.38 R3.1
N$33
  Bottom 0.61: R4.1 42.2,82.89 S4.NO@2
N$34
  Bottom 0.61: R5.1 53.34,80.38 S5.NO@2
N$35
  Bottom 0.61: R6.1 65.06,82.89 S6.NO@2
N$36
  Bottom 0.61: R7.1 76.49,82.89 S7.NO@2
N$54
  Bottom 0.61: R8.1 87.92,82.89 S8.NO@2
N$55
  Bottom 0.61: R9.1 99.35,82.89 S9.NO@2
N$56
  Bottom 0.61: R10.1 110.78,82.89 S10.NO@2
N$57
  Bottom 0.61: 121.92,80.38 S11.NO@2 123.19,81.06 R11.1
N$58
  Bottom 0.61: R12.1 133.35,79.38 133.64,79.67 S12.NO@2
N$59
  Bottom 0.61: R13.1 144.78,80.38 S13.NO@2
N$60
  Bottom 0.61: R14.1 156.21,80.38 S14.NO@2
N$61
  Bottom 0.61: R15.1 167.64,80.38 S15.NO@2
N$62
  Bottom 0.61: R16.1 179.07,80.38 S16.NO@2
N$63
  Bottom 0.61: R17.1 191.77,81.01 S17.NO@2
N$64
  Bottom 0.61: R18.1 201.93,80.38 S18.NO@2
N$65
  Bottom 0.61: R19.1 214.63,81.64 S19.NO@2
N$66
  Bottom 0.61: R20.1 225.08,81.57 S20.NO@2
N$67
  Bottom 0.61: R21.1 236.22,81.64 S21.NO@2
N$68
  Bottom 0.61: S22.NO@2 248.28,80.43 R22.1
N$69
  Bottom 0.61: R23.1 260.35,81.06 S23.NO@2
N$70
  Bottom 0.61: S24.NO@2 271.78,81.64 R24.1
N$71  (via drill 1.02)
  Top 0.61: v41.91,37.47 v57.15,37.47
  Bottom 0.61: v41.91,37.47 39.37,37.47 38.1,38.73 38.1,39.37 35.56,41.91 35.56,42.55 IC1.3 | IC7.11 91.44,47.62 90.49,46.67 87.31,46.67 85.09,44.45 85.09,41.27 81.28,37.47 v57.15,37.47
N$72  (via drill 1.02)
  Top 0.61: v40.01,39.37 v55.24,39.37
  Bottom 0.61: IC7.8 83.82,42.55 80.64,39.37 v55.24,39.37 | IC1.4 35.56,45.09 36.83,43.81 36.83,42.55 v40.01,39.37
N$73
  Bottom 0.61: S19.NO@1 213.65,57.5 215.9,55.25 IC4.2
N$74
  Bottom 0.61: S20.NO@1 225.08,58.77 226.06,57.78 IC4.1
N$75
  Bottom 0.61: S21.NO@1 241.3,68.8 241.3,51.44 240.03,50.16 IC4.13
N$76
  Bottom 0.61: S22.NO@1 247.94,50.45 245.11,47.62 IC4.12
N$77
  Bottom 0.61: S23.NO@1 259.37,51.73 252.73,45.09 IC4.11
N$78
  Bottom 0.61: S24.NO@1 270.8,51.73 261.62,42.55 IC4.10
N$79
  Bottom 0.61: S18.NO@1 202.22,61.31 210.82,52.7 IC4.3
N$80  (via drill 1.02)
  Top 0.61: IC7.6 86.36,57.78 85.09,59.06 80.01,59.06 76.2,55.25 76.2,47.62 71.12,42.55 v46.99,42.55
  Bottom 0.61: IC1.7 36.83,52.7 v46.99,42.55
N$81
  Top 0.61: IC1.8 35.56,55.25 39.37,59.06 39.37,67.94 43.18,71.75 85.09,71.75 93.98,62.86 IC7.3
N$82
  Bottom 0.61: IC4.14 235.59,52.7 234.31,51.44 234.31,38.73 228.6,33.02 178.44,33.02 176.53,34.92 IC6.2
N$83
  Top 0.61: IC5.1 83.82,41.27 81.28,43.81 76.2,43.81 64.77,32.38 40.64,32.38 38.1,34.92 38.1,52.7 41.91,56.52 41.91,65.41 44.45,67.94 50.8,67.94 53.34,65.41 53.34,61.59 55.88,59.06 IC2.14
N$84
  Bottom 0.61: IC2.4 43.18,56.52 29.84,69.85 11.64,69.85 S1.NO@1
N$85  (via drill 1.02)
  Top 0.61: v168.28,34.29 177.8,34.29 179.07,35.56 IC6.3
  Bottom 0.61: IC5.2 90.17,38.73 92.71,36.2 92.71,24.77 93.98,23.5 109.22,23.5 123.19,37.47 161.29,37.47 164.47,34.29 v168.28,34.29
N$86
  Bottom 0.61: S9.NO@1 99.35,70.19 110.49,59.06 IC3.4
N$87
  Bottom 0.61: S16.NO@1 179.36,56.8 173.99,51.44 IC3.10
N$88
  Bottom 0.61: S15.NO@1 167.93,58.08 163.83,53.98 IC3.11
N$89
  Bottom 0.61: S14.NO@1 156.5,60.61 152.4,56.52 IC3.12
N$90
  Bottom 0.61: S13.NO@1 145.49,73.58 149.86,69.22 149.86,60.33 148.59,59.06 IC3.13
N$91
  Bottom 0.61: S12.NO@1 133.64,68.92 135.89,66.67 IC3.1
N$92
  Bottom 0.61: S11.NO@1 122.21,68.92 127,64.14 IC3.2
N$93
  Bottom 0.61: S10.NO@1 110.78,65.11 114.3,61.59 IC3.3
N$94  (via drill 1.02)
  Top 0.61: v33.66,62.86 28.57,62.86 IC1.11 | v80.01,41.27 80.01,38.73 82.55,36.2 IC5.3
  Bottom 0.61: v80.01,41.27 52.7,41.27 45.09,48.89 45.09,52.7 34.93,62.86 v33.66,62.86
N$98  (via drill 1.02)
  Top 0.61: IC2.15 60.96,61.59 62.23,62.86 62.23,66.67 59.05,69.85 43.81,69.85 40.64,66.67 40.64,57.78 36.83,53.98 36.83,28.57 v35.56,27.3 | IC3.5 130.81,56.52 124.46,62.86 124.46,75.56 123.19,76.83 63.5,76.83 58.42,81.92 40.64,81.92 35.56,76.83 29.84,76.83 22.86,68.58 22.86,56.52 24.13,55.25 24.77,55.25 | IC1.13 24.77,55.25 | 24.77,55.25 22.86,53.34 22.86,40.01 v21.59,38.73
  Bottom 0.61: v35.56,27.3 27.94,27.3 19.05,36.2 19.05,37.47 20.32,38.73 v21.59,38.73
N$151
  Bottom 0.61: IC9.15 26.67,116.2 13.97,103.5 R25.2
N$152
  Bottom 0.61: LED1.K R25.1
N$153
  Bottom 0.61: R26.2 27.94,106.05 35.56,113.66 IC9.14
N$154
  Bottom 0.61: R27.2 39.37,103.5 46.99,111.12 IC9.13
N$155
  Bottom 0.61: IC9.12 50.8,108.58 48.26,106.05 R28.2
N$156
  Bottom 0.61: IC9.11 55.88,106.05 57.15,104.77 57.15,100.97 59.69,98.42 R29.2
N$157
  Top 0.61: IC9.10 54.61,103.5 55.88,102.23 55.88,99.69 56.52,99.06 71.75,99.06 R30.2
N$158
  Top 0.61: R31.2 78.74,84.45 77.88,85.32 51.21,85.32 50.16,86.36 50.16,100.33 50.8,100.97 IC9.9
N$159
  Bottom 0.61: IC9.7 90.17,103.5 93.98,100.97 R32.2
N$160
  Bottom 0.61: R33.2 106.68,113.66 109.22,116.2 IC8.15
N$161
  Bottom 0.61: R34.2 113.03,99.69 113.03,112.39 114.3,113.66 IC8.14
N$162
  Bottom 0.406: 121.92,100.97 121.92,100.33 124.46,97.79 128.91,97.79 R35.2
  Bottom 0.61: IC8.13 118.74,111.12 121.92,107.95 121.92,100.97
N$163
  Bottom 0.406: R36.2 136.53,99.06 133.99,96.52 124.46,96.52 120.65,100.33
  Bottom 0.61: IC8.12 118.74,108.58 120.65,106.68 120.65,100.33
N$164
  Bottom 0.406: 151.13,97.16 136.53,97.16 134.62,95.25 123.19,95.25 121.28,97.16
  Bottom 0.61: 151.13,97.16 R37.2 | IC8.11 117.47,106.05 119.38,104.14 119.38,99.06 121.28,97.16
N$165  (via drill 1.02)
  Top 0.61: IC8.10 118.11,103.5 120.65,100.97 120.65,87 121.92,85.72 127.64,85.72 128.27,86.36 v128.27,86.41
  Bottom 0.61: R38.2 161.93,86.36 136.53,86.36 135.89,85.72 129.54,85.72 128.91,86.36 128.32,86.36 v128.27,86.41
N$166  (via drill 1.02)
  Top 0.61: IC8.9 118.74,99.06 118.74,85.72 120.02,84.45 135.25,84.45 v135.89,83.82
  Bottom 0.61: v135.89,83.82 136.53,83.82 137.8,85.09 173.36,85.09 R39.2
N$167
  Bottom 0.61: IC8.7 176.53,103.5 182.88,97.16 R40.2
N$168
  Top 0.61: IC15.15 190.5,116.2 189.87,115.57 189.87,100.33 191.77,98.42 R41.2
N$169
  Top 0.61: IC15.14 201.93,113.66 208.28,107.31 R42.2
N$170
  Bottom 0.61: IC15.13 210.82,111.12 R43.2
N$171  (via drill 1.02)
  Top 0.61: R44.2 233.68,85.72 232.41,84.45 220.98,84.45 219.71,85.72 219.71,99.69 v210.82,108.58
  Bottom 0.61: IC15.12 v210.82,108.58
N$172
  Bottom 0.406: 242.57,98.42 R45.2
  Bottom 0.61: IC15.11 210.82,106.05 219.08,97.79 241.94,97.79 R45.2
N$173
  Bottom 0.61: IC15.10 209.55,103.5 215.9,97.16 217.81,97.16 218.44,96.52 253.37,96.52 R46.2
N$174  (via drill 1.02)
  Top 0.61: IC15.9 201.93,100.97 205.74,97.16 209.55,97.16 212.09,94.61 v212.09,92.08
  Bottom 0.61: R47.2 266.7,87 265.43,85.72 213.36,85.72 212.09,87 v212.09,92.08
N$175  (via drill 1.02)
  Top 0.61: v187.96,99.69 189.23,98.42 189.23,87 191.77,84.45 v198.12,84.45
  Bottom 0.61: IC15.7 186.69,103.5 187.96,102.23 v187.96,99.69 | R48.2 273.05,84.45 v198.12,84.45
N$176
  Bottom 0.61: R26.1 26.67,93.34 LED2.K
N$177
  Bottom 0.61: R27.1 LED3.K
N$178
  Bottom 0.61: R28.1 LED4.K
N$179
  Bottom 0.61: LED5.K 57.15,92.71 57.79,92.08 R29.1
N$180
  Bottom 0.61: LED6.K R30.1
N$181
  Bottom 0.61: LED7.K R31.1
N$182
  Bottom 0.61: LED8.K R32.1
N$183
  Bottom 0.61: LED9.K 105.41,93.34 R33.1
N$184
  Bottom 0.61: LED10.K 115.57,93.34 R34.1
N$185
  Bottom 0.61: LED11.K R35.1
N$186
  Bottom 0.406: LED12.K 140.34,93.34 R36.1
N$187
  Bottom 0.61: R37.1 LED13.K
N$188
  Bottom 0.61: LED14.K R38.1
N$189
  Bottom 0.61: LED15.K R39.1
N$190
  Bottom 0.61: LED16.K 184.15,92.08 R40.1
N$191
  Bottom 0.61: LED17.K R41.1
N$192
  Bottom 0.61: LED18.K 207.65,93.34 R42.1
N$193
  Bottom 0.61: LED19.K 221.62,93.34 222.25,93.98 R43.1
N$194
  Bottom 0.61: LED20.K 229.24,92.71 R44.1
N$195
  Bottom 0.61: LED21.K 242.57,93.34 R45.1
N$196
  Bottom 0.61: LED22.K R46.1
N$199
  Bottom 0.61: LED23.K R47.1
N$200
  Bottom 0.61: LED24.K R48.1
RS
  Bottom 0.61: JP5.4 JP1.4
VCC  (via drill 1.02)
  Top 0.61: IC3.16 167.64,66.67 173.99,60.33 IC6.14 | C7.1 234.95,85.72 R21.2 234.95,89.53 227.97,89.53 R20.2 LED20.A | R13.2 143.51,88.27 142.24,87 142.24,71.75 C3.1 | IC9.16 54.61,118.74 55.88,117.47 55.88,108.58 58.42,106.05 IC9.6 86.36,106.05 88.9,103.5 LED8.A | JP5.2 140.97,18.41 139.7,19.69 95.25,19.69 | 95.25,19.69 33.02,19.69 26.67,26.04 C4.1 | v50.8,79.38 v50.8,74.3 | IC5.14 95.25,41.27 92.71,38.73 92.71,22.23 95.25,19.69
  Bottom 0.61: C7.1 236.86,60.33 237.49,59.69 IC4.16 | IC2.16 C10.1 v50.8,74.3 | C11.1 142.24,20.95 140.97,19.69 JP5.2 JP1.2 140.97,6.98 143.51,4.45 | 143.51,4.45 177.8,4.45 181.61,8.25 181.61,17.14 170.18,28.57 170.18,36.2 167.64,38.73 167.64,42.55 168.91,43.81 C6.1 172.72,45.09 IC6.14 | 143.51,4.45 137.16,4.45 135.89,5.71 JP2.10 | R24.2 LED24.A 269.24,95.88 262.89,95.88 LED23.A R23.2 R22.2 | LED22.A 248.92,88.27 R22.2 | LED3.A 31.75,89.53 R3.2 | LED2.A R2.2 | R1.2 8.89,89.53 LED1.A 11.43,95.88 17.78,95.88 LED2.A | LED2.A 22.86,95.88 29.21,95.88 LED3.A | R18.2 203.2,89.53 LED18.A 205.74,95.88 | R17.2 LED17.A | R16.2 180.34,89.53 LED16.A 182.88,95.88 | R15.2 168.91,89.53 LED15.A 171.45,95.88 | R14.2 157.48,89.53 LED14.A | R13.2 146.05,89.53 LED13.A | R12.2 134.62,89.53 | R11.2 123.19,90.8 | 123.19,90.8 LED11.A 123.19,87 111.76,87 R10.2 111.76,89.53 LED10.A 110.49,95.88 102.87,95.88 | R9.2 100.33,89.53 LED9.A 102.87,95.88 | R8.2 88.9,89.53 LED8.A 91.44,95.88 | R7.2 77.47,89.53 LED7.A 77.47,94.61 78.74,95.88 | LED17.A 194.31,95.88 | 194.31,95.88 192.41,95.88 190.5,97.79 190.5,117.47 191.77,118.74 IC15.16 C2.1 | 171.45,95.88 182.88,95.88 | C12.1 IC8.16 106.68,118.74 101.6,113.66 101.6,99.69 97.79,95.88 | LED13.A 148.59,95.88 156.21,95.88 157.48,94.61 LED14.A | LED14.A 160.02,95.88 171.45,95.88 | 91.44,95.88 97.79,95.88 | 97.79,95.88 102.87,95.88 | 78.74,95.88 91.44,95.88 | 78.74,95.88 68.58,95.88 LED6.A 66.04,89.53 R6.2 53.98,88.27 R5.2 54.61,89.53 LED5.A 53.34,95.88 45.72,95.88 | 45.72,95.88 LED4.A 43.18,89.53 R4.2 45.09,88.9 50.8,83.19 v50.8,79.38 | LED3.A 34.29,95.88 45.72,95.88 | C3.1 144.78,70.48 146.05,69.22 IC3.16
  Bottom 0.61: C8.1 101.6,50.16 100.33,48.89 IC7.14 99.06,46.36 96.52,43.81 C1.1 IC5.14 | R21.2 237.49,88.9 LED21.A 237.49,89.53 239.4,87.63 R22.2 | 205.74,95.88 217.17,95.88 LED19.A R19.2 215.27,88.27 226.06,88.27 LED20.A | 194.31,95.88 205.74,95.88 | C4.1 IC1.20 | 134.62,89.53 LED12.A 137.16,95.88 143.51,95.88 LED13.A | 134.62,89.53 133.35,88.27 132.08,88.27 130.81,89.53 124.46,89.53 123.19,90.8 | C9.1 48.26,120.02 49.53,118.74 IC9.16 | 182.88,95.88 184.15,95.88 185.42,94.61 190.5,94.61 LED17.A

### Text on the board
Top: WORLD CLOCK | SANYAM JAIN 2017UEC3182 | ANMOL GULATI 2017UEC2195